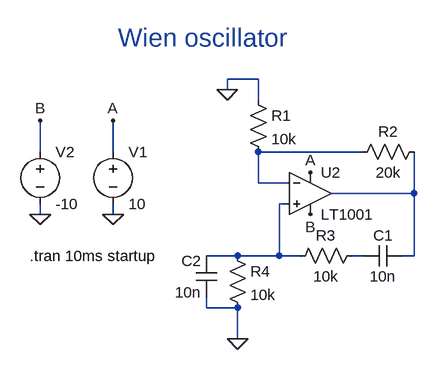
[diagram p0: schematic Wien-oscillator.asc]
Wien-oscillator.asc, the LTspice schematic file:
Version 4
SHEET 1 880 680
WIRE 80 0 32 0
WIRE 32 16 32 0
WIRE 80 32 80 0
WIRE -256 112 -256 64
WIRE -144 112 -144 64
WIRE 240 112 80 112
WIRE 80 160 80 112
WIRE 128 160 80 160
WIRE 320 176 320 112
WIRE 320 176 192 176
WIRE 128 192 112 192
WIRE -256 208 -256 192
WIRE -144 208 -144 192
WIRE 48 272 0 272
WIRE 112 272 112 192
WIRE 112 272 48 272
WIRE 144 272 112 272
WIRE 240 272 224 272
WIRE 320 272 320 176
WIRE 320 272 304 272
WIRE 0 352 0 336
WIRE 48 352 0 352
WIRE 48 400 48 352
FLAG 160 144 A
FLAG 32 16 0
FLAG 48 400 0
FLAG -144 208 0
FLAG -144 64 A
FLAG -256 64 B
FLAG 160 208 B
FLAG -256 208 0
SYMBOL res 64 16 R0
SYMATTR InstName R1
SYMATTR Value 10k
SYMBOL res 336 96 R90
WINDOW 0 0 56 VBottom 2
WINDOW 3 32 56 VTop 2
SYMATTR InstName R2
SYMATTR Value 20k
SYMBOL res 240 256 R90
WINDOW 0 0 56 VBottom 2
WINDOW 3 32 56 VTop 2
SYMATTR InstName R3
SYMATTR Value 10k
SYMBOL cap 304 256 R90
WINDOW 0 0 32 VBottom 2
WINDOW 3 32 32 VTop 2
SYMATTR InstName C1
SYMATTR Value 10n
SYMBOL cap 16 336 R180
WINDOW 0 24 56 Left 2
WINDOW 3 24 8 Left 2
SYMATTR InstName C2
SYMATTR Value 10n
SYMBOL res 32 256 R0
SYMATTR InstName R4
SYMATTR Value 10k
SYMBOL voltage -144 96 R0
WINDOW 123 0 0 Left 2
WINDOW 39 0 0 Left 2
SYMATTR InstName V1
SYMATTR Value 10
SYMBOL Opamps\\LT1001 160 112 R0
SYMATTR InstName U2
SYMBOL voltage -256 96 R0
WINDOW 123 0 0 Left 2
WINDOW 39 0 0 Left 2
SYMATTR InstName V2
SYMATTR Value -10
TEXT -272 272 Left 2 !.tran 10ms startup
TEXT -136 -64 Left 4 ;Wien oscillator

The netlist it stands for:
* Wien-oscillator.asc
R1 0 N001 10k
R2 N002 N001 20k
R3 N004 N003 10k
C1 N002 N004 10n
C2 0 N003 10n
R4 N003 0 10k
V1 A 0 10
XU2 N003 N001 A B N002 LT1001  ; pins In+ In- V+ V- OUT
V2 B 0 -10
.tran 10ms startup
* Wien oscillator
.lib LTC.lib
.backanno
.end